# EAGLE design untitled (EAGLE 7.7.0)
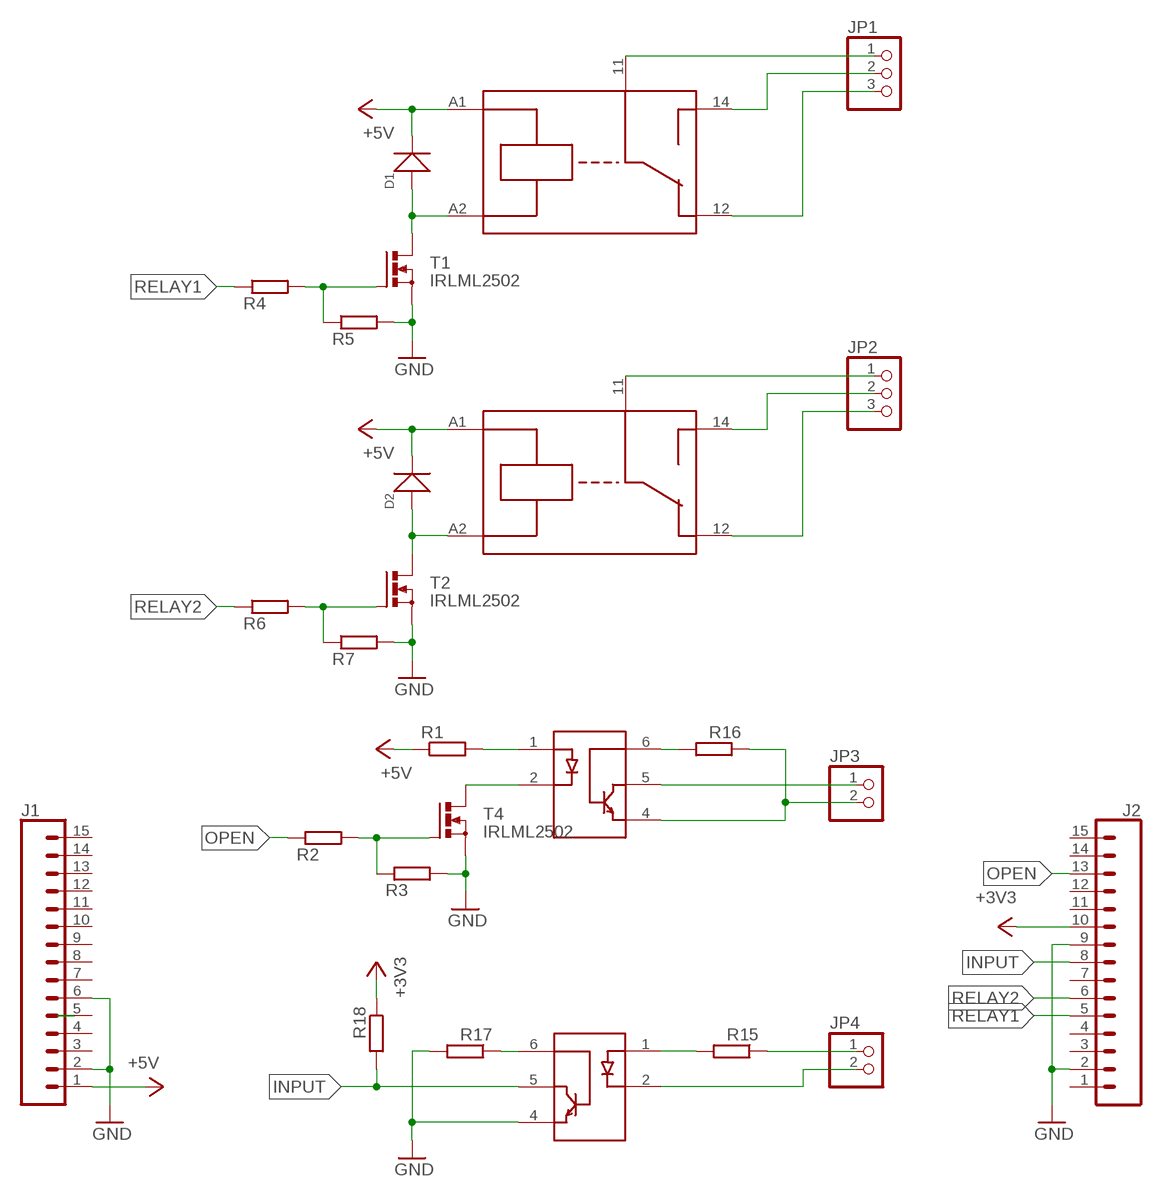
[diagram p0: schematic, sheet 1]

## Parts
D1  1N4007  DIODE-GEN-PURPOSE-1KV-1A(DO-214AC)  [DO-214AC]
D2  1N4007  DIODE-GEN-PURPOSE-1KV-1A(DO-214AC)  [DO-214AC]
J1  CONN_15  [1X15]
J2  CONN_15  [1X15]
JP1  PINHD-1X3  [1X03]
JP2  PINHD-1X3  [1X03]
JP3  PINHD-1X2  [1X02]
JP4  PINHD-1X2  [1X02]
R1  R-EU_R0805  [R0805]
R2  R-EU_R0805  [R0805]
R3  R-EU_R0805  [R0805]
R4  R-EU_R0805  [R0805]
R5  R-EU_R0805  [R0805]
R6  R-EU_R0805  [R0805]
R7  R-EU_R0805  [R0805]
R15  R-EU_R0805  [R0805]
R16  R-EU_R0805  [R0805]
R17  R-EU_R0805  [R0805]
R18  R-EU_R0805  [R0805]
T1  IRLML2502  [SOT23]
T2  IRLML2502  [SOT23]
T4  IRLML2502  [SOT23]
U$5  PE0140  [PE0140]
U$6  PE0140  [PE0140]
U$7  4N35  [DIL06-SMD]
U$8  4N35  [DIL06-SMD]

## Nets
+3V3: J2.10 R18.1
+5V: D1.2(-) D2.2(-) J1.1 R1.1 U$5.A1 U$6.A1
GND: J1.2 J1.6 J2.2 J2.9 R3.2 R5.2 R7.2 R17.2 T1.2(S) T2.2(S) T4.2(S) U$8.4(E)
INPUT: J2.8 R18.2 U$8.5(COL)
N$1: R4.2 R5.1 T1.1(G)
N$2: R6.2 R7.1 T2.1(G)
N$3: R1.2 U$7.1(A)
N$4: T4.3(D) U$7.2(CAT)
N$5: D1.1(+) T1.3(D) U$5.A2
N$7: D2.1(+) T2.3(D) U$6.A2
N$12: R2.2 R3.1 T4.1(G)
N$24: JP1.1 U$5.11
N$25: JP1.2 U$5.14
N$26: JP1.3 U$5.12
N$27: JP2.1 U$6.11
N$28: JP2.2 U$6.14
N$29: JP2.3 U$6.12
N$30: JP4.2 U$8.2(CAT)
N$31: JP4.1 R15.1
N$32: R15.2 U$8.1(A)
N$33: JP3.1 U$7.5(COL)
N$34: JP3.2 R16.1 U$7.4(E)
N$35: R16.2 U$7.6(B)
N$37: R17.1 U$8.6(B)
OPEN: J2.13 R2.1
RELAY1: J2.5 R4.1
RELAY2: J2.6 R6.1
Unconnected: J1.3 J1.4 J1.5 J1.7 J1.8 J1.9 J1.10 J1.11 J1.12 J1.13 J1.14 J1.15 J2.1 J2.3 J2.4 J2.7 J2.11 J2.12 J2.14 J2.15

## Library data of the parts
D1 D2 = unt:DIODE-GEN-PURPOSE-1KV-1A(DO-214AC): 304010013; MPN: 1N4007
J1 J2 = unt:CONN_15: Multi connection point. Often used as Generic Header-pin footprint for 0.1 inch spaced/style header connections On any of the 0.1 inch spaced packages, you can populate with these: Break Away Headers - Straight <https://www.sparkfun.com/products/116> (PRT-00116) Break Away Male Headers - Right Angle <https://www.sparkfun.com/products/553> (PRT-00553) Female Headers <https://www.sparkfun.com/products/115> (PRT-00115) Break Away Headers - Machine Pin <https://www.sparkfun.com/products/117> (PRT-00117) Break Away Female Headers - Swiss Machine Pin <https://www.sparkfun.com/products/743> (PRT-00743) For SCREWTERMINALS and SPRING TERMINALS visit here: Screw Terimnals on SparkFun.com <https://www.sparkfun.com/search/results?term=Screw+Terminals> (5mm/3.5mm/2.54mm spacing) This device is also useful as a general connection point to wire up your design to another part of your project. Our various solder wires solder well into these plated through hole pads. Hook-Up Wire - Assortment (Stranded, 22 AWG) <https://www.sparkfun.com/products/11375> (PRT-11375) Hook-Up Wire - Assortment (Solid Core, 22 AWG) <https://www.sparkfun.com/products/11367> (PRT-11367) View the entire wire category on our website here <https://www.sparkfun.com/categories/141> Special notes: Molex polarized connector foot print use with SKU : PRT-08231 with associated crimp pins and housings. 1MM SMD Version SKU: PRT-10208 NOTES ON THE VARIANTS LOCK and LOCK_LONGPADS... This footprint was designed to help hold the alignment of a through-hole component (i.e. 6-pin header) while soldering it into place. You may notice that each hole has been shifted either up or down by 0.005 of an inch from it's more standard position (which is a perfectly straight line). This slight alteration caused the pins (the squares in the middle) to touch the edges of the holes. Because they are alternating, it causes a "brace" to hold the component in place. 0.005 has proven to be the perfect amount of "off-center" position when using our standard breakaway headers. Although looks a little odd when you look at the bare footprint, once you have a header in there, the alteration is very hard to notice. Also,if you push a header all the way into place, it is covered up entirely on the bottom side.
JP1 JP2 = unt:PINHD-1X3: PIN HEADER
JP3 JP4 = unt:PINHD-1X2: PIN HEADER
R1-R7 R15-R18 = rcl:R-EU_: RESISTOR, European symbol
T1 T2 T4 = unt:IRLML2502
U$5 U$6 = unt:PE0140
U$7 U$8 = unt:4N35

## Board
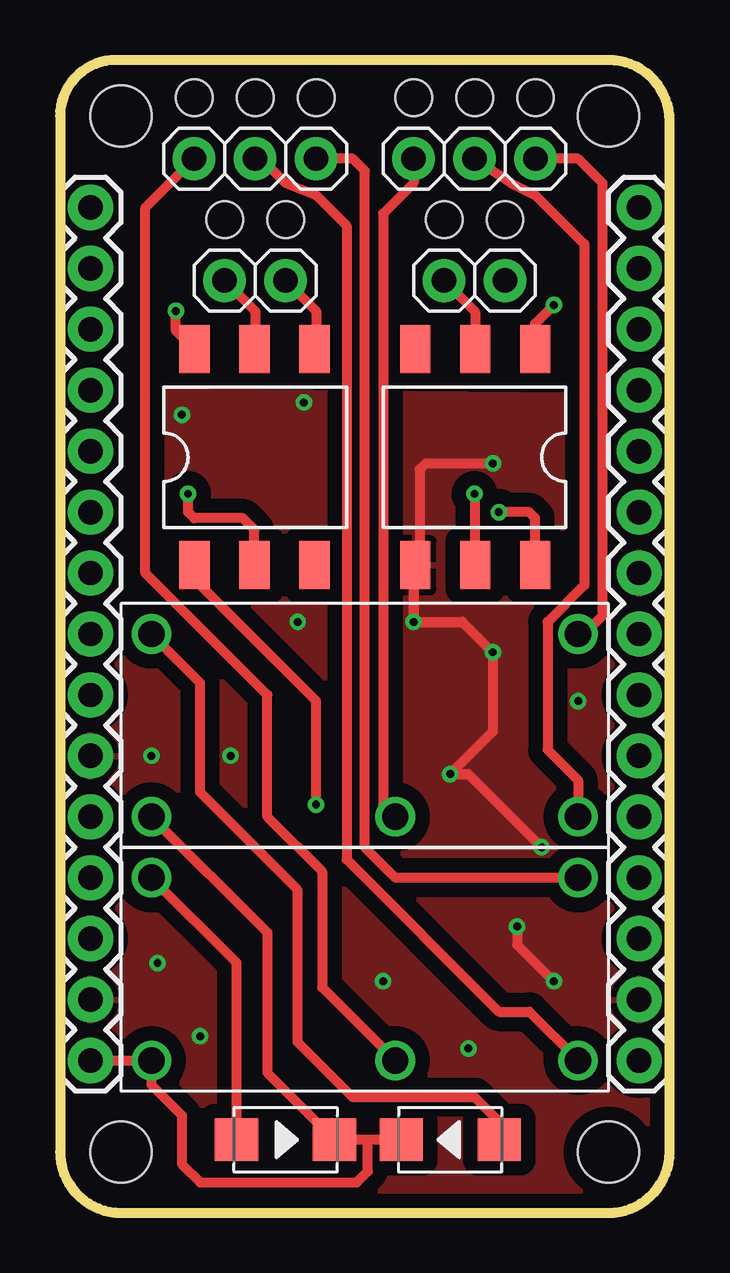
[diagram p1: board, top side]
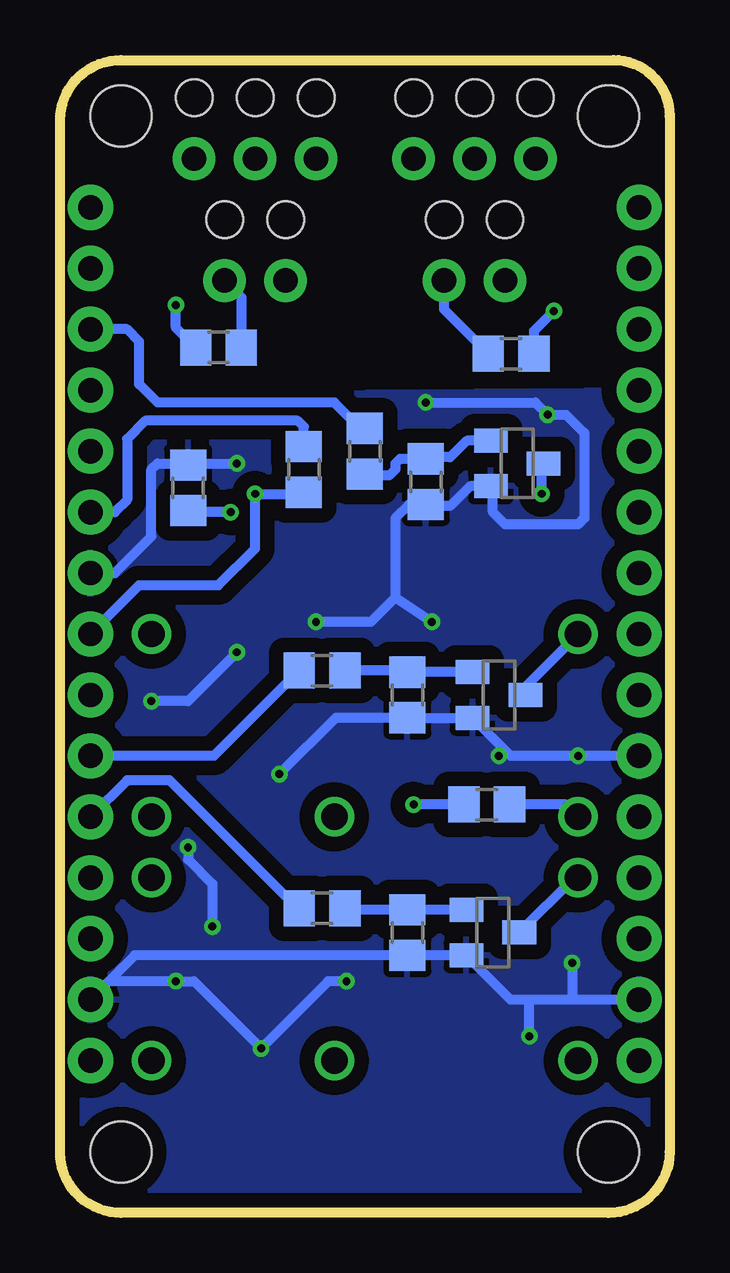
[diagram p2: board, bottom side, seen from below]

Size 25.4 x 48.06 mm. Coordinates in mm from the lower left corner, seen from the top.
Outline: 2.54,0 22.86,0 arc90 25.4,2.54 25.4,45.52 arc90 22.86,48.06 2.34,48.06 arc90 0,45.72 0,2.54 arc90 2.54,0
Copper layers (1*16): Top 0.0356mm / dielectric 1.5011mm / Bottom 0.0356mm
Design rules "oshpark-2layer": minimum track width 6mil, minimum drill 13mil, track to track 6mil, track to pad 6mil, pad to pad 6mil, via to via 6mil, smd to smd 6mil, copper to edge 15mil, drill to drill 6mil, minimum pad ring 7mil, minimum via ring 7mil, stop-mask expansion 2.5mil, vias tented up to drill 0mil, thermal gap 10mil
Holes 2.54 mm at 2.54,2.54 22.86,2.54 2.54,45.72 22.86,45.72
Holes 1.52 mm at 5.59,46.48 8.13,46.48 10.67,46.48 14.73,46.48 6.86,41.4 9.4,41.4 17.27,46.48 19.81,46.48 16,41.4 18.54,41.4

### Footprints (pad centres in the part's own frame; a part is rotated, then mirrored left to right if it is on the bottom)
DO-214AC = smd 1.8 x 1.77: 1 -2.042,0; 2 2.042,0
1X15 = drill 1.016 pad 1.88: 1 0,0; 2 2.54,0; 3 5.08,0; 4 7.62,0; 5 10.16,0; 6 12.7,0; 7 15.24,0; 8 17.78,0; 9 20.32,0; 10 22.86,0; 11 25.4,0; 12 27.94,0; 13 30.48,0; 14 33.02,0; 15 35.56,0
1X03 = drill 1.016 pad 1.778: 1 -2.54,0; 2 0,0; 3 2.54,0
1X02 = drill 1.016 pad 1.778: 1 -1.27,0; 2 1.27,0
R0805 = smd 1.3 x 1.5: 1 -0.95,0; 2 0.95,0
SOT23 = smd 1 x 1.4: 1 -0.95,-1.1; 2 0.95,-1.1; 3 0,1.1
PE0140 = drill 1.1: 11 10.16,0; 12 17.78,7.62; 14 17.78,0; A1 0,0; A2 0,7.62
DIL06-SMD = smd 1.27 x 2: 1 -3.8,-4.5; 2 -1.3,-4.5; 3 1.2,-4.5; 4 1.2,4.5; 5 -1.3,4.5; 6 -3.8,4.5

### Placement (x,y rotation side)
D1  9.4,3.05 0 top
D2  16.26,3.05 180 top
J1  1.27,6.35 90 top
J2  24.13,6.35 90 top
JP1  8.13,43.94 0 top
JP2  17.27,43.94 0 top
JP3  8.13,38.86 0 top
JP4  17.27,38.86 180 top
R1  7.62,17.02 180 bottom
R2  12.7,31.75 270 bottom
R3  10.16,30.48 270 bottom
R4  14.48,12.7 0 bottom
R5  10.92,11.68 270 bottom
R6  14.48,22.61 0 bottom
R7  10.92,21.59 270 bottom
R15  18.8,36.07 180 bottom
R16  6.6,35.81 0 bottom
R17  20.07,30.23 90 bottom
R18  15.24,30.99 270 bottom
T1  7.37,11.68 270 bottom
T2  7.11,21.59 270 bottom
T4  6.35,31.24 270 bottom
U$5  3.81,6.35 0 top
U$6  3.81,16.51 0 top
U$7  9.4,31.5 0 top
U$8  16,31.5 180 top

### Tracks (layer width: path | path; a pad name or v marks a point on that pad's centre or on a via)
+3V3
  Bottom 0.406: R18.1 15.24,32.77 15.49,33.02 21.84,33.02 22.61,32.26 22.61,29.72 23.11,29.21 J2.10
+5V
  Top 0.406: J1.1 U$5.A1 3.81,5.33 5.08,4.06 5.08,2.03 5.84,1.27 12.37,1.27 12.83,1.73 12.83,3.05 | 12.83,3.05 D1.2 8.64,5.84 8.64,11.68 U$6.A1 | D2.2 12.83,3.05
  Bottom 0.406: U$6.A1 4.32,17.02 R1.1
GND  (via drill 0.33)
  Top 0.406: v14.73,24.64 14.73,26.93 U$8.4 | U$8.4 14.73,27 v14.73,24.64 | v14.73,24.64 16.76,24.64 v18.03,23.37 18.03,20.07 v16.26,18.29 17.02,18.29 v20.07,15.24 | v19.05,11.94 19.05,11.18 v20.57,9.65 | v18.03,31.24 15.24,31.24 14.99,30.99 14.99,27.18 U$8.4
  Bottom 0.406: J1.2 4.06,8.89 | 4.06,8.89 5.84,8.89 | 5.84,8.89 6.62,8.89 T1.2 R5.2 22.29,10.73 J2.2 23.37,9.65 v20.57,9.65 19.81,9.65 v17.02,6.86 14.22,9.65 v13.46,9.65 | J1.6 v3.81,19.05 6.62,19.05 T2.2 R7.2 13.9,20.64 v16.26,18.29 | 11.43,25.65 11.43,28.96 10.86,29.53 R3.2 10.09,29.46 9.14,29.46 8.32,30.29 T4.2 7.37,30.21 7.37,29.21 6.86,28.7 3.81,28.7 3.56,28.96 3.56,32.51 4.32,33.27 v5.08,33.27 5.59,33.78 v10.16,33.78 | 11.43,25.65 12.45,24.64 v14.73,24.64 | v9.91,24.64 11.43,25.65 | v18.03,23.37 20.07,21.34 v21.59,21.34 | v20.07,15.24 20.07,14.73 19.05,13.72 v19.05,11.94 | v4.06,10.41 4.06,8.89 | v5.84,7.37 5.84,8.89 | 20.13,31.24 21.34,31.24 21.59,30.99 21.59,28.19 23.11,26.67 J2.9 | 20.13,31.24 R17.2 | 20.13,31.24 v18.03,31.24
  other vias: 7.11,19.05
  pour Top (isolate 0.61): -0.25,-0.25 -0.25,34.29 25.65,34.04 25.65,-0.25
  pour Bottom (isolate 0.61): -1.02,-1.27 -1.02,34.29 26.42,34.04 26.42,-1.27
INPUT  (via drill 0.33)
  Top 0.406: v17.27,29.97 17.27,27.03 U$8.5
  Bottom 0.406: J2.8 22.1,26.16 18.8,26.16 17.27,27.69 v17.27,29.97 15.24,29.97 R18.2
N$1
  Bottom 0.406: T1.1 R5.1 13.53,12.63 R4.2
N$2
  Bottom 0.406: T2.1 R7.1 10.99,22.61 R6.2
N$3  (via drill 0.33)
  Top 0.406: v10.67,17.02 10.67,21.34 5.59,26.42 5.59,26.99 U$7.1
  Bottom 0.406: R1.2 v10.67,17.02
N$4  (via drill 0.33)
  Top 0.406: U$7.2 8.1,28.48 7.62,28.96 5.59,28.96 5.33,29.21 v5.33,29.97
  Bottom 0.406: v5.33,29.97 5.33,31.16 T4.3
N$5
  Top 0.406: D1.1 7.36,10.42 U$5.A2
  Bottom 0.406: U$5.A2 3.98,13.97 T1.3
N$7
  Top 0.406: D2.1 18.3,3.8 17.27,4.83 12.19,4.83 9.91,7.11 9.91,13.46 5.84,17.53 5.84,22.1 U$6.A2
  Bottom 0.406: U$6.A2 6.01,21.93 T2.3
N$12
  Bottom 0.406: R2.2 12.63,30.73 11.68,30.73 11.43,30.99 11.43,31.24 11.24,31.43 R3.1 10.09,31.5 9.14,31.5 8.45,32.19 T4.1
N$24
  Top 0.406: JP1.1 3.56,41.91 3.56,26.67 8.64,21.59 8.64,16.51 10.92,14.22 10.92,9.4 U$5.11
N$25
  Top 0.406: U$5.14 19.56,8.38 18.29,8.38 11.94,14.73 11.94,41.15 10.67,42.42 9.4,42.93 8.38,43.94 JP1.2
N$26
  Top 0.406: U$5.12 13.97,13.97 12.7,15.24 12.7,43.43 12.19,43.94 JP1.3
N$27
  Top 0.406: JP2.1 14.73,42.93 13.46,41.66 13.46,17.02 U$6.11
N$28
  Top 0.406: U$6.14 21.59,18.03 20.32,19.3 20.32,24.64 21.84,26.16 21.84,40.39 19.81,42.42 18.8,42.93 JP2.2
N$29
  Top 0.406: U$6.12 21.84,24.13 22.61,24.89 22.61,42.93 21.59,43.94 JP2.3
N$30
  Top 0.406: JP4.2 17.3,37.56 U$8.2
N$31
  Bottom 0.406: JP4.1 17.85,38.17 R15.1
N$32  (via drill 0.33)
  Top 0.406: v20.57,37.85 19.8,37.07 U$8.1
  Bottom 0.406: R15.2 20.57,36.9 v20.57,37.85
N$33
  Top 0.406: JP3.1 8.13,37.59 8.13,36 U$7.5
N$34
  Top 0.406: JP3.2 10.67,37.59 10.67,36 U$7.4
  Bottom 0.406: R16.1 9.4,37.66 JP3.2
N$35  (via drill 0.33)
  Top 0.406: U$7.6 4.83,36.77 v4.83,37.59
  Bottom 0.406: v4.83,37.59 5.65,36.76 R16.2
N$37  (via drill 0.33)
  Top 0.406: 19.81,27.01 U$8.6 19.8,28.97 19.56,29.21 v18.29,29.21
  Bottom 0.406: v18.29,29.21 20,29.21 R17.1
OPEN
  Bottom 0.406: R2.1 12.89,32.7 13.97,33.78 21.34,33.78 22.1,34.54 22.1,36.32 22.61,36.83 J2.13
RELAY1
  Bottom 0.406: R4.1 15.49,12.7 20.83,18.03 22.61,18.03 J2.5
RELAY2
  Bottom 0.406: R6.1 18.98,19.05 J2.6